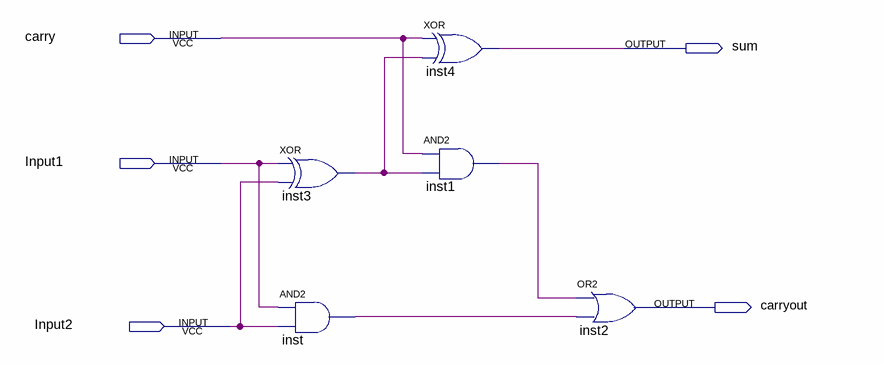
[diagram p0: schematic sheet]
// Quartus schematic fulladder.bdf as structural Verilog: 5 symbols, 5 pins
module fulladder (
  input  carry,
  input  Input1,
  input  Input2,
  output sum,
  output carryout
);

  wire inst1_out, inst3_out, inst_out;

  xor inst3 (inst3_out, Input1, Input2);
  and inst (inst_out, Input1, Input2);
  xor inst4 (sum, carry, inst3_out);
  and inst1 (inst1_out, carry, inst3_out);
  or inst2 (carryout, inst1_out, inst_out);
endmodule
